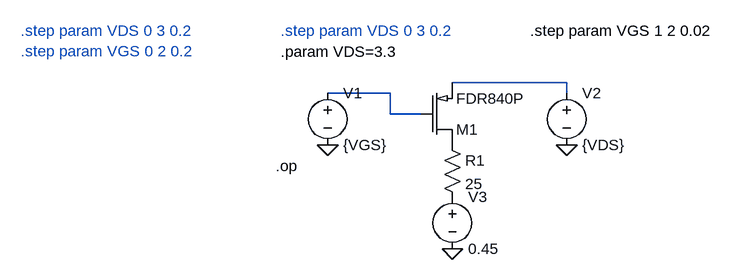
[diagram p0: schematic pMOStest2.asc]
pMOStest2.asc, the LTspice schematic file:
Version 4
SHEET 1 880 680
WIRE 352 128 176 128
WIRE 80 144 -16 144
WIRE 352 144 352 128
WIRE 80 176 80 144
WIRE 128 176 80 176
FLAG -16 224 0
FLAG 352 224 0
FLAG 176 384 0
SYMBOL voltage -16 128 R0
SYMATTR InstName V1
SYMATTR Value {VGS}
SYMBOL voltage 352 128 R0
SYMATTR InstName V2
SYMATTR Value {VDS}
SYMBOL res 160 208 R0
SYMATTR InstName R1
SYMATTR Value 25
SYMBOL voltage 176 288 R0
SYMATTR InstName V3
SYMATTR Value 0.45
SYMBOL PMOSbook 160 176 R0
SYMATTR Value FDR840P
SYMATTR InstName M1
TEXT -488 48 Left 0 ;.step param VDS 0 3 0.2\n.step param VGS 0 2 0.2
TEXT -96 256 Left 0 !.op
TEXT -88 48 Left 0 ;.step param VDS 0 3 0.2
TEXT 296 48 Left 0 !.step param VGS 1 2 0.02
TEXT -88 80 Left 0 !.param VDS=3.3

The netlist it stands for:
* pMOStest2.asc
V1 N002 0 {VGS}
V2 N001 0 {VDS}
R1 P001 P002 25
V3 P002 0 0.45
M1 P001 N002 N001 N001 FDR840P
.model NMOS NMOS
.model PMOS PMOS
.lib standard.mos
* .step param VDS 0 3 0.2
* .step param VGS 0 2 0.2
.op
* .step param VDS 0 3 0.2
.step param VGS 1 2 0.02
.param VDS=3.3
.backanno
.end